# EAGLE schematic MainECU rev7 (EAGLE 9.2.2)
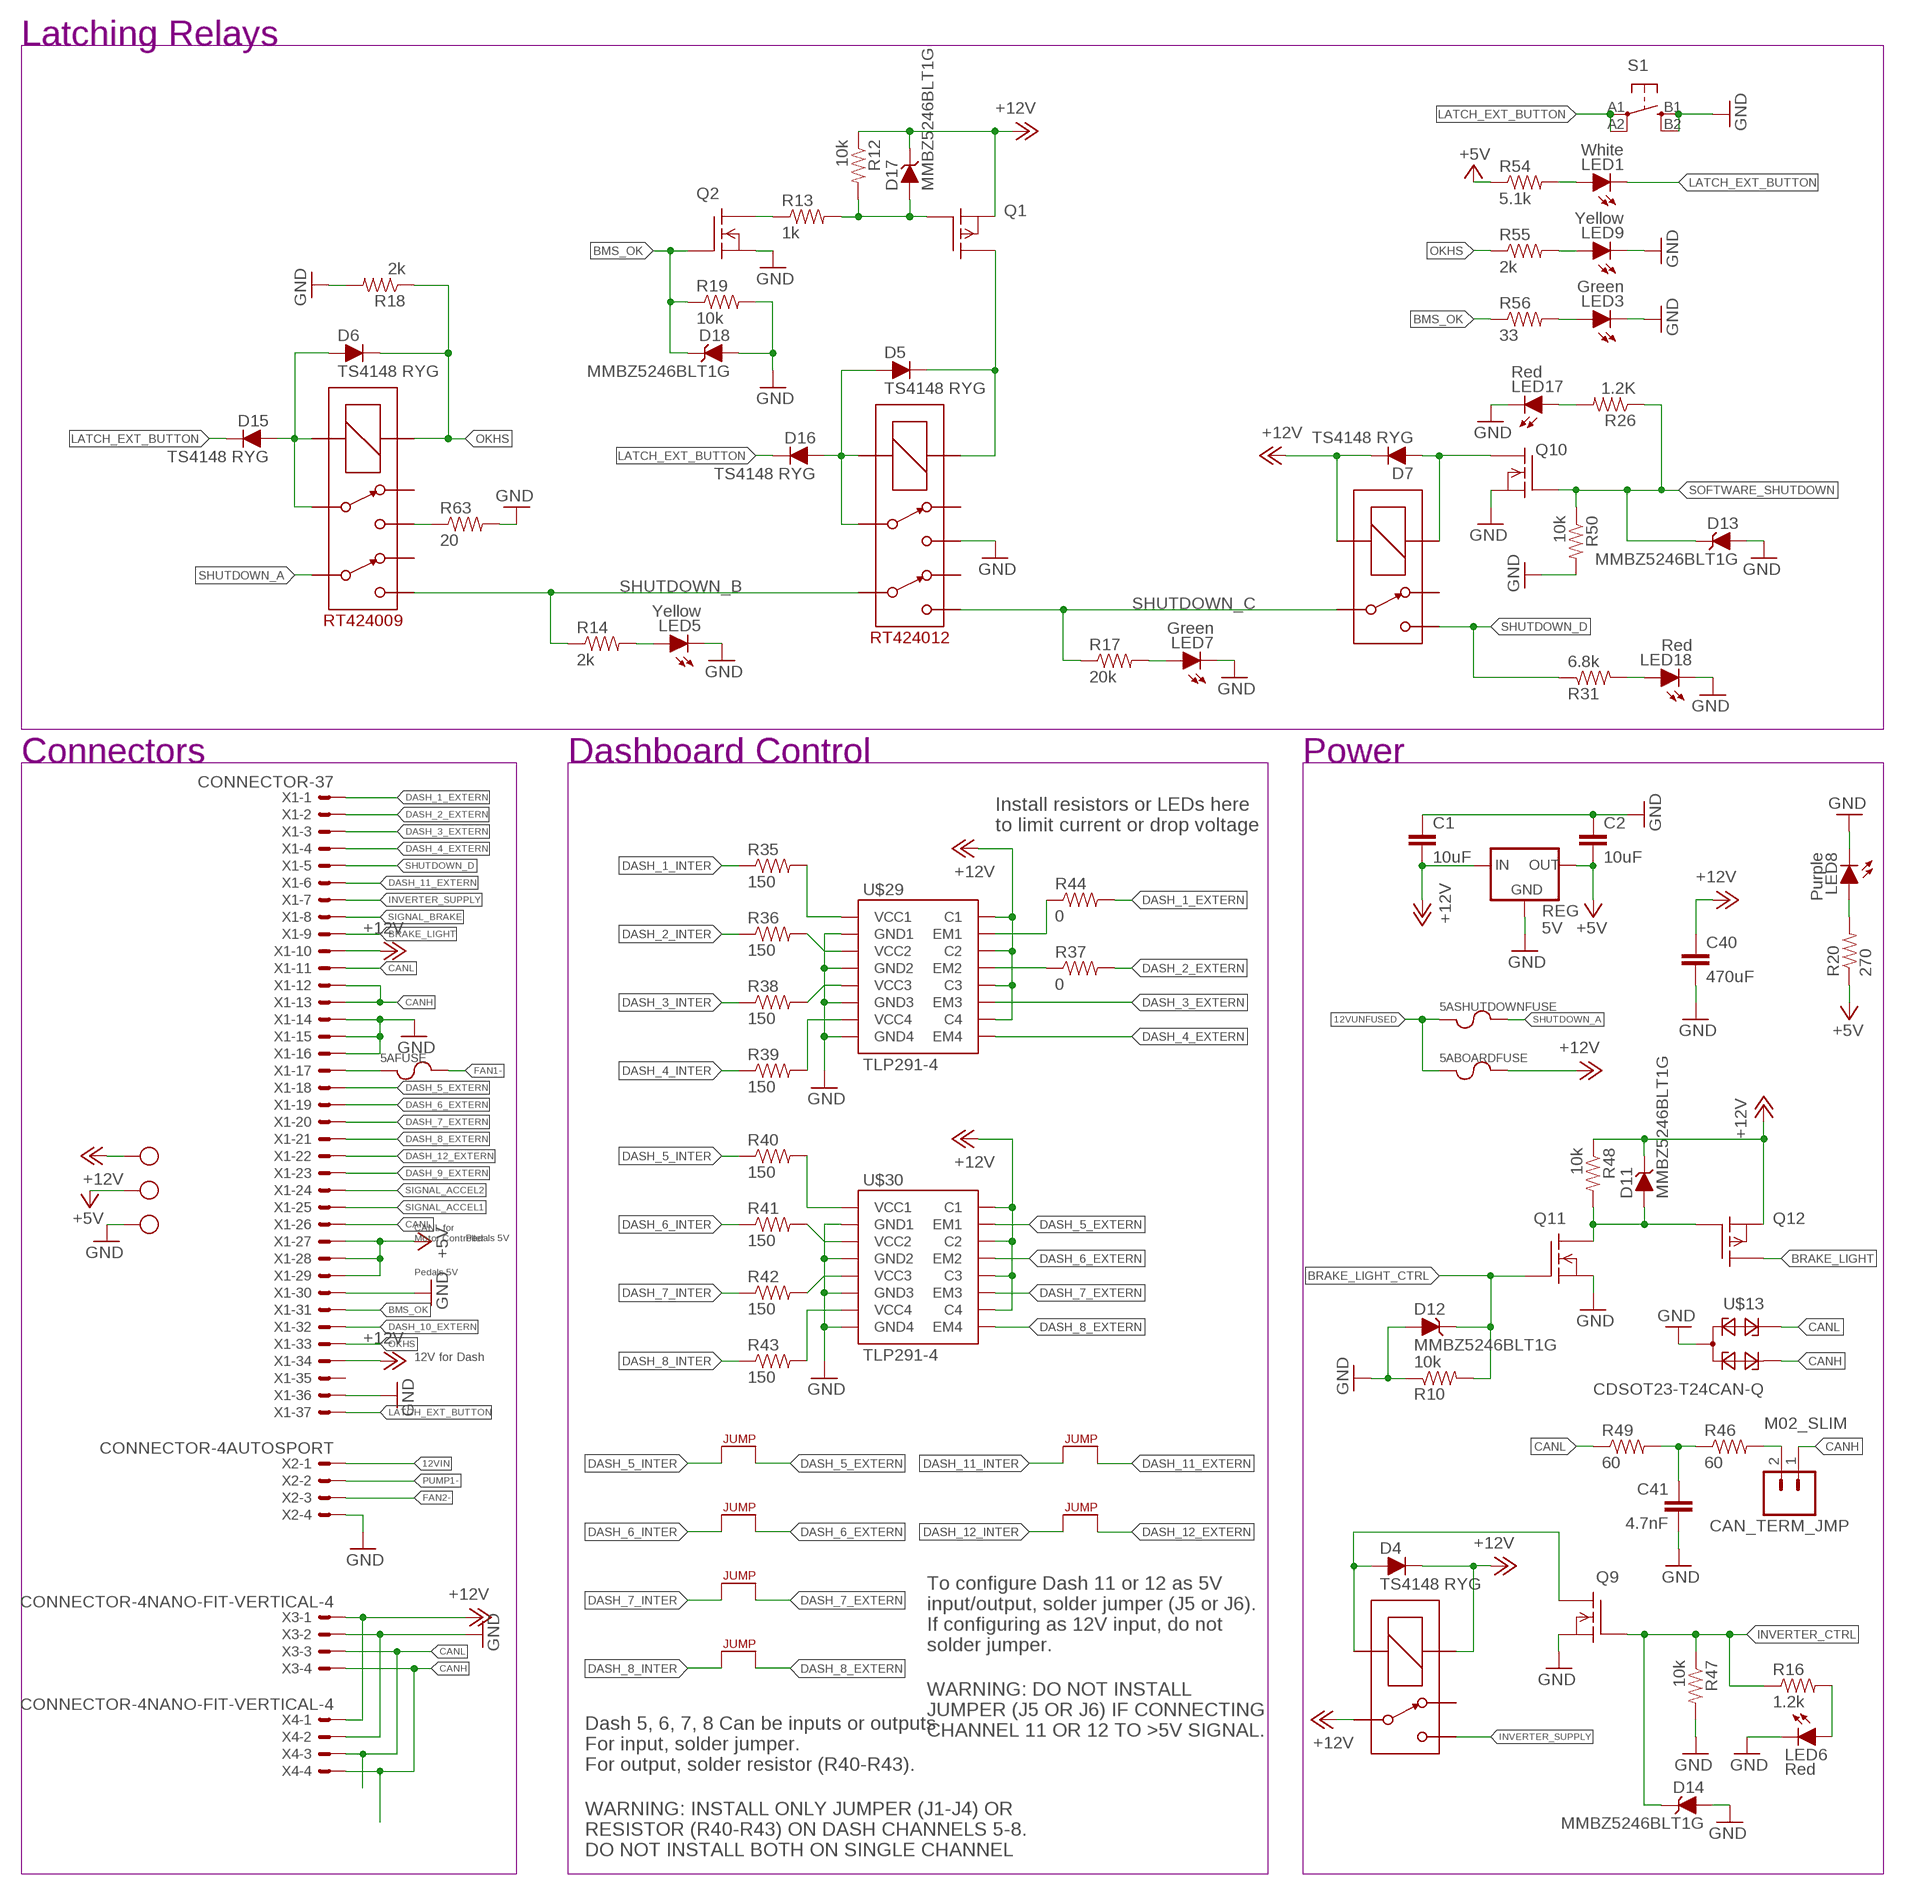
[diagram p0: schematic, sheet 1, part 1 of 2]
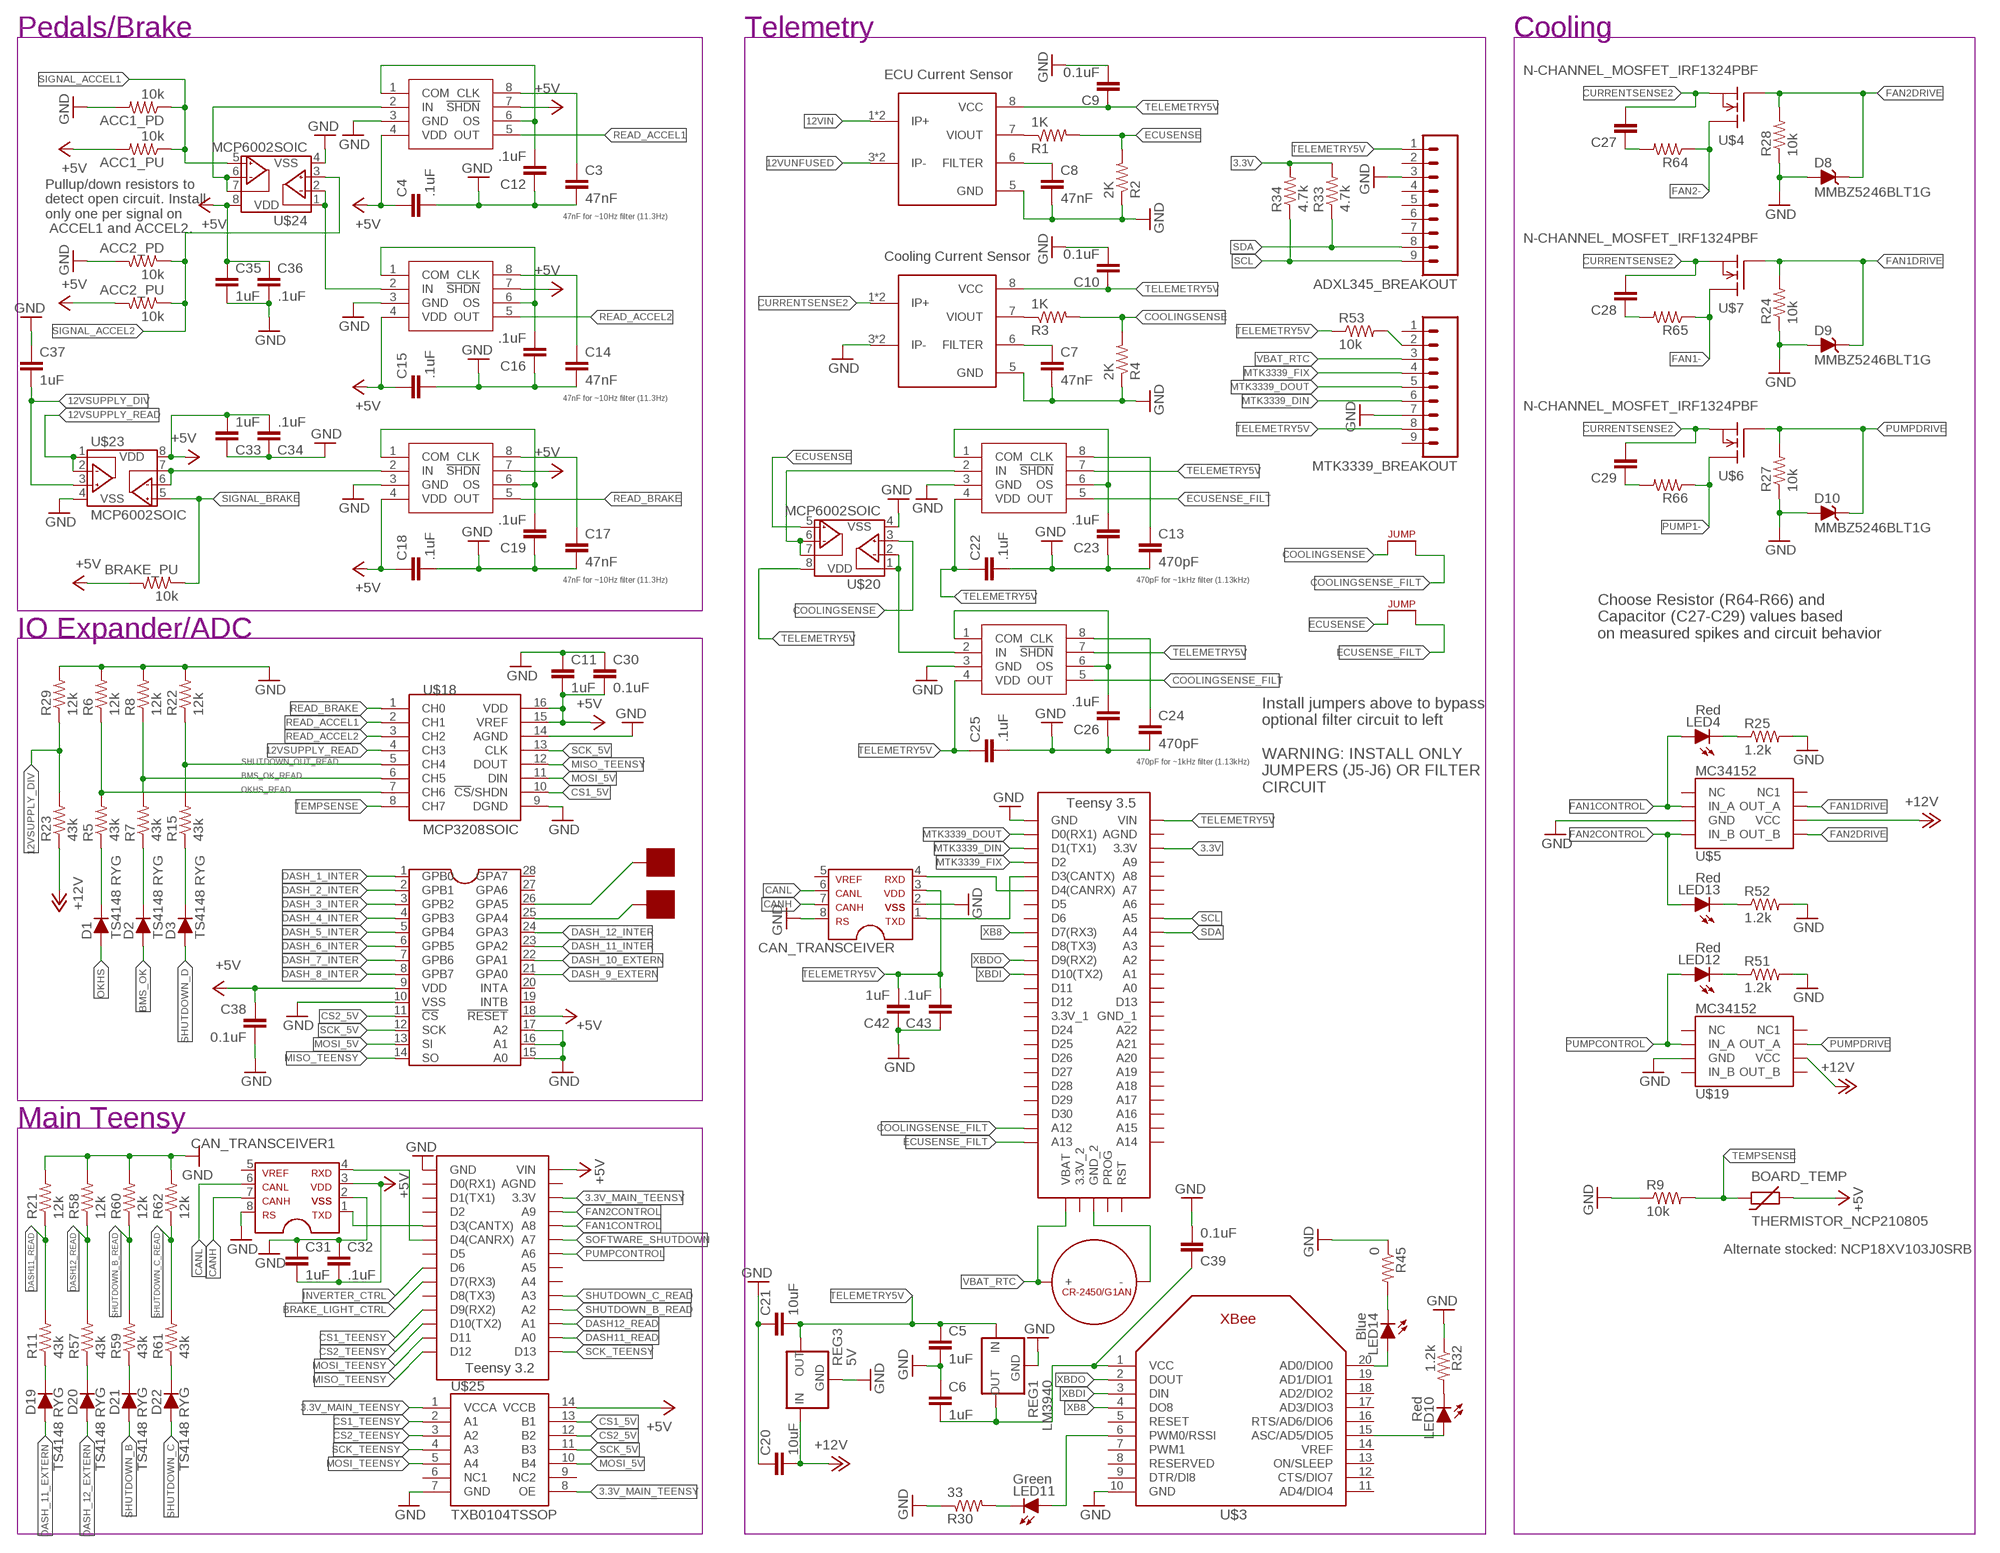
[diagram p1: schematic, sheet 1, part 2 of 2]

## Parts
5ABOARDFUSE  FUSE_MINIBLADE  [MINI-BLADE_FUSE_HOLDER]
5AFUSE  FUSE_MINIBLADE  [MINI-BLADE_FUSE_HOLDER]
5ASHUTDOWNFUSE  FUSE_MINIBLADE  [MINI-BLADE_FUSE_HOLDER]
ACC1_PD  10k  RESISTOR0805-RES  [0805]
ACC1_PU  10k  RESISTOR0805-RES  [0805]
ACC2_PD  10k  RESISTOR0805-RES  [0805]
ACC2_PU  10k  RESISTOR0805-RES  [0805]
ADXL345_BREAKOUT  M09  [1X09]
BMS_SHUTDOWN_RLY  RT424012  [RELAY_DPDT]
BOARD_TEMP  THERMISTOR_NCP210805  [0805]
BRAKE_PU  10k  RESISTOR0805-RES  [0805]
C1  10uF  CAP0805  [0805]
C2  10uF  CAP0805  [0805]
C3  47nF  CAP0805  [0805]
C4  .1uF  CAP0805  [0805]
C5  1uF  CAP0805  [0805]
C6  1uF  CAP0805  [0805]
C7  47nF  CAP0805  [0805]
C8  47nF  CAP0805  [0805]
C9  0.1uF  CAP0805  [0805]
C10  0.1uF  CAP0805  [0805]
C11  1uF  CAP0805  [0805]
C12  .1uF  CAP0805  [0805]
C13  470pF  CAP0805  [0805]
C14  47nF  CAP0805  [0805]
C15  .1uF  CAP0805  [0805]
C16  .1uF  CAP0805  [0805]
C17  47nF  CAP0805  [0805]
C18  .1uF  CAP0805  [0805]
C19  .1uF  CAP0805  [0805]
C20  10uF  CAP0805  [0805]
C21  10uF  CAP0805  [0805]
C22  .1uF  CAP0805  [0805]
C23  .1uF  CAP0805  [0805]
C24  470pF  CAP0805  [0805]
C25  .1uF  CAP0805  [0805]
C26  .1uF  CAP0805  [0805]
C27  CAP0805  [0805]
C28  CAP0805  [0805]
C29  CAP0805  [0805]
C30  0.1uF  CAP0805  [0805]
C31  1uF  CAP0805  [0805]
C32  .1uF  CAP0805  [0805]
C33  1uF  CAP0805  [0805]
C34  .1uF  CAP0805  [0805]
C35  1uF  CAP0805  [0805]
C36  .1uF  CAP0805  [0805]
C37  1uF  CAP0805  [0805]
C38  0.1uF  CAP0805  [0805]
C39  0.1uF  CAP0805  [0805]
C40  470uF  CAPPTH3  [CAP-PTH-LARGE]
C41  4.7nF  CAP0805  [0805]
C42  1uF  CAP0805  [0805]
C43  .1uF  CAP0805  [0805]
CAN_TERM_JMP  M02_SLIM  [1X02_SLIM]
CAN_TRANSCEIVER  MCP2551  [SOIC-08]
CAN_TRANSCEIVER1  MCP2551  [SOIC-08]
D1  TS4148 RYG  DIODE0805  [0805_D]
D2  TS4148 RYG  DIODE0805  [0805_D]
D3  TS4148 RYG  DIODE0805  [0805_D]
D4  TS4148 RYG  DIODE0805  [0805_D]
D5  TS4148 RYG  DIODE0805  [0805_D]
D6  TS4148 RYG  DIODE0805  [0805_D]
D7  TS4148 RYG  DIODE0805  [0805_D]
D8  MMBZ5246BLT1G  DIODE_ZENER  [SOT23]
D9  MMBZ5246BLT1G  DIODE_ZENER  [SOT23]
D10  MMBZ5246BLT1G  DIODE_ZENER  [SOT23]
D11  MMBZ5246BLT1G  DIODE_ZENER  [SOT23]
D12  MMBZ5246BLT1G  DIODE_ZENER  [SOT23]
D13  MMBZ5246BLT1G  DIODE_ZENER  [SOT23]
D14  MMBZ5246BLT1G  DIODE_ZENER  [SOT23]
D15  TS4148 RYG  DIODE0805  [0805_D]
D16  TS4148 RYG  DIODE0805  [0805_D]
D17  MMBZ5246BLT1G  DIODE_ZENER  [SOT23]
D18  MMBZ5246BLT1G  DIODE_ZENER  [SOT23]
D19  TS4148 RYG  DIODE0805  [0805_D]
D20  TS4148 RYG  DIODE0805  [0805_D]
D21  TS4148 RYG  DIODE0805  [0805_D]
D22  TS4148 RYG  DIODE0805  [0805_D]
IMD_SHUTDOWN_RLY  RT424009  [RELAY_DPDT]
INVERTER_PWR_RELAY  G5LE  [ZF112]
J1  JUMPER  [0805]
J2  JUMPER  [0805]
J3  JUMPER  [0805]
J4  JUMPER  [0805]
J5  JUMPER  [0805]
J6  JUMPER  [0805]
J7  JUMPER  [0805]
J8  JUMPER  [0805]
LED1  White  LED-0805  [LED-805]
LED3  Green  LED-0805  [LED-805]
LED4  Red  LED-0805  [LED-805]
LED5  Yellow  LED-0805  [LED-805]
LED6  Red  LED-0805  [LED-805]
LED7  Green  LED-0805  [LED-805]
LED8  Purple  LED-0805  [LED-805]
LED9  Yellow  LED-0805  [LED-805]
LED10  Red  LED-0805  [LED-805]
LED11  Green  LED-0805  [LED-805]
LED12  Red  LED-0805  [LED-805]
LED13  Red  LED-0805  [LED-805]
LED14  Blue  LED-0805  [LED-805]
LED17  Red  LED-0805  [LED-805]
LED18  Red  LED-0805  [LED-805]
MTK3339_BREAKOUT  M09  [1X09]
P1  SOLDER_PAD  [SOLDER_PAD_XSMALL]
P2  SOLDER_PAD  [SOLDER_PAD_XSMALL]
Q1  P-CHANNEL_MOSFET_DMP3099L-7  [SOT23]
Q2  DMG3406LSOT  [SOT23]
Q9  DMG3406LSOT  [SOT23]
Q10  DMG3406LSOT  [SOT23]
Q11  DMG3406LSOT  [SOT23]
Q12  P-CHANNEL_MOSFET_DMP3099L-7  [SOT23]
R1  1K  RESISTOR0805-RES  [0805]
R2  2K  RESISTOR0805-RES  [0805]
R3  1K  RESISTOR0805-RES  [0805]
R4  2K  RESISTOR0805-RES  [0805]
R5  43k  RESISTOR0805-RES  [0805]
R6  12k  RESISTOR0805-RES  [0805]
R7  43k  RESISTOR0805-RES  [0805]
R8  12k  RESISTOR0805-RES  [0805]
R9  10k  RESISTOR0805-RES  [0805]
R10  10k  RESISTOR0805-RES  [0805]
R11  43k  RESISTOR0805-RES  [0805]
R12  10k  RESISTOR0805-RES  [0805]
R13  1k  RESISTOR0805-RES  [0805]
R14  2k  RESISTOR0805-RES  [0805]
R15  43k  RESISTOR0805-RES  [0805]
R16  1.2k  RESISTOR0805-RES  [0805]
R17  20k  RESISTOR0805-RES  [0805]
R18  2k  RESISTOR0805-RES  [0805]
R19  10k  RESISTOR0805-RES  [0805]
R20  270  RESISTOR0805-RES  [0805]
R21  12k  RESISTOR0805-RES  [0805]
R22  12k  RESISTOR0805-RES  [0805]
R23  43k  RESISTOR0805-RES  [0805]
R24  10k  RESISTOR0805-RES  [0805]
R25  1.2k  RESISTOR0805-RES  [0805]
R26  1.2K  RESISTOR0805-RES  [0805]
R27  10k  RESISTOR0805-RES  [0805]
R28  10k  RESISTOR0805-RES  [0805]
R29  12k  RESISTOR0805-RES  [0805]
R30  33  RESISTOR0805-RES  [0805]
R31  6.8k  RESISTOR0805-RES  [0805]
R32  1.2k  RESISTOR0805-RES  [0805]
R33  4.7k  RESISTOR0805-RES  [0805]
R34  4.7k  RESISTOR0805-RES  [0805]
R35  150  RESISTOR0805-RES  [0805]
R36  150  RESISTOR0805-RES  [0805]
R37  0  RESISTOR0805-RES  [0805]
R38  150  RESISTOR0805-RES  [0805]
R39  150  RESISTOR0805-RES  [0805]
R40  150  RESISTOR0805-RES  [0805]
R41  150  RESISTOR0805-RES  [0805]
R42  150  RESISTOR0805-RES  [0805]
R43  150  RESISTOR0805-RES  [0805]
R44  0  RESISTOR0805-RES  [0805]
R45  0  RESISTOR0805-RES  [0805]
R46  60  RESISTOR0805-RES  [0805]
R47  10k  RESISTOR0805-RES  [0805]
R48  10k  RESISTOR0805-RES  [0805]
R49  60  RESISTOR0805-RES  [0805]
R50  10k  RESISTOR0805-RES  [0805]
R51  1.2k  RESISTOR0805-RES  [0805]
R52  1.2k  RESISTOR0805-RES  [0805]
R53  10k  RESISTOR0805-RES  [0805]
R54  5.1k  RESISTOR0805-RES  [0805]
R55  2k  RESISTOR0805-RES  [0805]
R56  33  RESISTOR0805-RES  [0805]
R57  43k  RESISTOR0805-RES  [0805]
R58  12k  RESISTOR0805-RES  [0805]
R59  43k  RESISTOR0805-RES  [0805]
R60  12k  RESISTOR0805-RES  [0805]
R61  43k  RESISTOR0805-RES  [0805]
R62  12k  RESISTOR0805-RES  [0805]
R63  20  RESISTOR0805-RES  [0805]
R64  RESISTOR0805-RES  [0805]
R65  RESISTOR0805-RES  [0805]
R66  RESISTOR0805-RES  [0805]
REG  5V  OKI-78SR-5  [OKI-78SR]
REG1  LM3940  [SOT223]
REG3  5V  OKI-78SR-5  [OKI-78SR]
S1  BTN_10-XXSMD  [TACTILE_SWITCH_SMD_6.2MM_TALL]
SOFTWARE_SHUTDOWN_RLY  G5LE  [ZF112]
U$1  TEENSY_3.2_SIMPLE  [TEENSY_3.2_SIMPLE]
U$2  TEENSY_3.5_EXT  [TEENSY_3.5_EXT]
U$3  XBEE  [XBEE]
U$4  N-CHANNEL_MOSFET_IRF1324PBF  N-CHANNEL_MOSFET_HOR_HOLE  [TO-220-H-HOLE]
U$5  MC34152  [SOIC-08]
U$6  N-CHANNEL_MOSFET_IRF1324PBF  N-CHANNEL_MOSFET_HOR_HOLE  [TO-220-H-HOLE]
U$7  N-CHANNEL_MOSFET_IRF1324PBF  N-CHANNEL_MOSFET_HOR_HOLE  [TO-220-H-HOLE]
U$8  TEST_POINT  [TEST_POINT]
U$9  ACS715_CURRENT_SENSOR  [SOP8]
U$10  ACS715_CURRENT_SENSOR  [SOP8]
U$11  TEST_POINT  [TEST_POINT]
U$12  TEST_POINT  [TEST_POINT]
U$13  CDSOT23-T24CAN-Q  [SOT23]
U$16  CR-2450/G1AN  [CR-2450/G1AN]
U$17  MCP23S17SSOP28  [SSOP28]
U$18  MCP3208SOIC  [SOIC-16]
U$19  MC34152  [SOIC-08]
U$20  MCP6002SOIC  [SOIC-08]
U$21  MAX7480  [SOIC-08]
U$22  MAX7480  [SOIC-08]
U$23  MCP6002SOIC  [SOIC-08]
U$24  MCP6002SOIC  [SOIC-08]
U$25  TXB0104TSSOP  [TSSOP-14]
U$26  MAX7480  [SOIC-08]
U$27  MAX7480  [SOIC-08]
U$28  MAX7480  [SOIC-08]
U$29  TLP291-4  [11-11F1]
U$30  TLP291-4  [11-11F1]
X1  CONNECTOR-37  [AUTOSPORT_14-35]
X2  CONNECTOR-4AUTOSPORT  [AUTOSPORT_12-04]
X3  CONNECTOR-4NANO-FIT-VERTICAL-4  [NANO-FIT_VERTICAL-4]
X4  CONNECTOR-4NANO-FIT-VERTICAL-4  [NANO-FIT_VERTICAL-4]

## Nets
3.3V: R33.2 R34.2 U$2.3.3V
3.3V_MAIN_TEENSY: U$1.3.3V U$25.1(VCCA) U$25.8(OE)
12VIN: U$9.1(IP+) U$9.2(IP+) X2.P$1
12VSUPPLY_DIV: C37.2 R23.2 R29.1 U$23.3(VINA+)
12VSUPPLY_READ: U$18.4(CH3) U$23.1(VOUTA) U$23.2(VINA-)
12VUNFUSED: 5ABOARDFUSE.L1 5ABOARDFUSE.L2 5ASHUTDOWNFUSE.L1 5ASHUTDOWNFUSE.L2 U$9.3(IP-) U$9.4(IP-)
+5V: ACC1_PU.2 ACC2_PU.2 BOARD_TEMP.1 BRAKE_PU.2 C2.2 C4.1 C11.2 C15.1 C18.1 C30.2 C31.2 C32.2 C33.2 C34.2 C35.1 C36.1 C38.1 CAN_TRANSCEIVER1.3 R20.1 R54.1 REG.3(OUT) U$1.VIN U$11.P$1 U$17.9(VDD) U$17.18(!RESET) U$18.15(VREF) U$18.16(VDD) U$23.8(VDD) U$24.8(VDD) U$25.14(VCCB) U$26.4(VDD) U$26.7(!SHDN) U$27.4(VDD) U$27.7(!SHDN) U$28.4(VDD) U$28.7(!SHDN) X1.P$27 X1.P$28 X1.P$29
+12V: 5ABOARDFUSE.R1 5ABOARDFUSE.R2 C1.2 C20.2 C40.1 D4.C D7.C D11.3(C) D17.3(C) INVERTER_PWR_RELAY.1(COIL+) INVERTER_PWR_RELAY.P Q1.2(S) Q12.2(S) R12.1 R23.1 R48.1 REG3.1(IN) REG.1(IN) SOFTWARE_SHUTDOWN_RLY.2(COIL-) U$5.6(VCC) U$8.P$1 U$19.6(VCC) U$29.10(C4) U$29.12(C3) U$29.14(C2) U$29.16(C1) U$30.10(C4) U$30.12(C3) U$30.14(C2) U$30.16(C1) X1.P$10 X1.P$34 X3.P$1 X4.P$1
BMS_OK: D2.A D18.3(C) Q2.1(G) R19.1 R56.1 X1.P$31
BMS_OK_READ: R7.2 R8.1 U$18.6(CH5)
BMS_OK_SW: BMS_SHUTDOWN_RLY.COIL+ D5.C Q1.3(D)
BMS_PWR_STEP: BMS_SHUTDOWN_RLY.3 BMS_SHUTDOWN_RLY.COIL- D5.A D16.A
BRAKE_LIGHT: Q12.3(D) X1.P$9
BRAKE_LIGHT_CTRL: D12.3(C) Q11.1(G) R10.2 U$1.D7(RX3)
CANH: CAN_TERM_JMP.1 CAN_TRANSCEIVER1.7 CAN_TRANSCEIVER.7 U$13.2 X1.P$12 X1.P$13 X3.P$4 X4.P$4
CANL: CAN_TRANSCEIVER1.6 CAN_TRANSCEIVER.6 R49.1 U$13.1 X1.P$11 X1.P$26 X3.P$3 X4.P$3
COOLINGSENSE: J5.2 R3.2 R4.2 U$20.3(VINA+)
COOLINGSENSE_FILT: J5.1 U$2.A12 U$22.5(OUT)
CS1_5V: U$18.10(!CS!/SHDN) U$25.13(B1)
CS1_TEENSY: U$1.D9(RX2) U$25.2(A1)
CS2_5V: U$17.11(!CS) U$25.12(B2)
CS2_TEENSY: U$1.D10(TX2) U$25.3(A2)
CURRENTSENSE2: C27.2 C28.2 C29.2 U$4.3(S) U$6.3(S) U$7.3(S) U$10.1(IP+) U$10.2(IP+)
DASH11_READ: R11.2 R21.1 U$1.A0
DASH12_READ: R57.2 R58.1 U$1.A1
DASH_1_EXTERN: R44.2 X1.P$1
DASH_1_INTER: R35.1 U$17.1(GPB0)
DASH_2_EXTERN: R37.2 X1.P$2
DASH_2_INTER: R36.1 U$17.2(GPB1)
DASH_3_EXTERN: U$29.11(EM3) X1.P$3
DASH_3_INTER: R38.1 U$17.3(GPB2)
DASH_4_EXTERN: U$29.9(EM4) X1.P$4
DASH_4_INTER: R39.1 U$17.4(GPB3)
DASH_5_EXTERN: J1.1 U$30.15(EM1) X1.P$18
DASH_5_INTER: J1.2 R40.1 U$17.5(GPB4)
DASH_6_EXTERN: J2.1 U$30.13(EM2) X1.P$19
DASH_6_INTER: J2.2 R41.1 U$17.6(GPB5)
DASH_7_EXTERN: J3.1 U$30.11(EM3) X1.P$20
DASH_7_INTER: J3.2 R42.1 U$17.7(GPB6)
DASH_8_EXTERN: J4.1 U$30.9(EM4) X1.P$21
DASH_8_INTER: J4.2 R43.1 U$17.8(GPB7)
DASH_9_EXTERN: U$17.21(GPA0) X1.P$23
DASH_10_EXTERN: U$17.22(GPA1) X1.P$32
DASH_11_EXTERN: D19.A J7.1 X1.P$6
DASH_11_INTER: J7.2 U$17.23(GPA2)
DASH_12_EXTERN: D20.A J8.1 X1.P$22
DASH_12_INTER: J8.2 U$17.24(GPA3)
ECUSENSE: J6.2 R1.2 R2.2 U$20.5(VINB+)
ECUSENSE_FILT: J6.1 U$2.A13 U$21.5(OUT)
FAN1-: 5AFUSE.R1 5AFUSE.R2 R65.1 U$7.2(D)
FAN1CONTROL: LED4.A U$1.A8 U$5.2(IN_A)
FAN1DRIVE: D9.3(C) R24.2 U$5.7(OUT_A) U$7.1(G)
FAN2-: R64.1 U$4.2(D) X2.P$3
FAN2CONTROL: LED13.A U$1.A9 U$5.4(IN_B)
FAN2DRIVE: D8.3(C) R28.2 U$4.1(G) U$5.5(OUT_B)
GND: ACC1_PD.2 ACC2_PD.2 ADXL345_BREAKOUT.3 BMS_SHUTDOWN_RLY.4 C1.1 C2.1 C3.2 C4.2 C5.2 C6.1 C7.2 C8.2 C9.2 C10.2 C11.1 C12.1 C13.2 C14.2 C15.2 C16.1 C17.2 C18.2 C19.1 C20.1 C21.1 C22.2 C23.1 C24.2 C25.2 C26.1 C30.1 C31.1 C32.1 C33.1 C34.1 C35.2 C36.2 C37.1 C38.2 C39.2 C40.2 C41.2 C42.1 C43.1 CAN_TRANSCEIVER1.2 CAN_TRANSCEIVER1.8 CAN_TRANSCEIVER.2 CAN_TRANSCEIVER.8 D8.1(A) D9.1(A) D10.1(A) D12.1(A) D13.1(A) D14.1(A) D18.1(A) LED3.C LED5.C LED6.C LED7.C LED8.C LED9.C LED17.C LED18.C MTK3339_BREAKOUT.7 Q2.2(S) Q9.2(S) Q10.2(S) Q11.2(S) R2.1 R4.1 R6.2 R8.2 R9.1 R10.1 R18.2 R19.2 R21.2 R22.2 R24.1 R25.2 R27.1 R28.1 R29.2 R30.1 R32.1 R45.1 R47.2 R50.2 R51.2 R52.2 R58.2 R60.2 R62.2 R63.2 REG1.2(GND) REG1.4(GND) REG3.2(GND) REG.2(GND) S1.B1(S) S1.B2(S1) U$1.GND U$2.GND U$3.10(GND) U$5.3(GND) U$9.5(GND) U$10.3(IP-) U$10.4(IP-) U$10.5(GND) U$12.P$1 U$13.3 U$17.10(VSS) U$17.15(A0) U$17.16(A1) U$17.17(A2) U$18.9(DGND) U$18.14(AGND) U$19.3(GND) U$20.4(VSS) U$21.3(GND) U$22.3(GND) U$23.4(VSS) U$24.4(VSS) U$25.7(GND) U$26.3(GND) U$27.3(GND) U$28.3(GND) U$29.2(GND1) U$29.4(GND2) U$29.6(GND3) U$29.8(GND4) U$30.2(GND1) U$30.4(GND2) U$30.6(GND3) U$30.8(GND4) X1.P$14 X1.P$15 X1.P$16 X1.P$30 X1.P$36 X2.P$4 X3.P$2 X4.P$2
IMD_PWR_STEP: D6.A D15.A IMD_SHUTDOWN_RLY.3 IMD_SHUTDOWN_RLY.COIL-
INVERTER_CTRL: D14.3(C) Q9.1(G) R16.1 R47.1 U$1.D6
INVERTER_SUPPLY: INVERTER_PWR_RELAY.S X1.P$7
LATCH_EXT_BUTTON: D15.C D16.C LED1.C S1.A1(P) S1.A2(P1) X1.P$37
MISO_TEENSY: U$1.D12 U$17.14(SO) U$18.12(DOUT)
MOSI_5V: U$17.13(SI) U$18.11(DIN) U$25.10(B4)
MOSI_TEENSY: U$1.D11 U$25.5(A4)
MTK3339_DIN: MTK3339_BREAKOUT.6 U$2.D1(TX1)
MTK3339_DOUT: MTK3339_BREAKOUT.5 U$2.D0(RX1)
MTK3339_FIX: MTK3339_BREAKOUT.4 U$2.D2
N$1: 5AFUSE.L1 5AFUSE.L2 X1.P$17
N$2: LED1.A R54.2
N$3: R1.1 U$9.7(VIOUT)
N$4: C12.2 U$27.1(COM) U$27.6(OS)
N$5: D20.C R57.1
N$6: R3.1 U$10.7(VIOUT)
N$7: MTK3339_BREAKOUT.2 R53.2
N$8: C8.1 U$9.6(FILTER)
N$9: LED3.A R56.2
N$10: D1.C R5.1
N$11: D2.C R7.1
N$12: D17.1(A) Q1.1(G) R12.2 R13.2
N$13: CAN_TRANSCEIVER.4 U$2.D4(CANRX)
N$14: CAN_TRANSCEIVER.1 U$2.D3(CANTX)
N$15: CAN_TRANSCEIVER1.4 U$1.D4(CANRX)
N$16: Q2.3(D) R13.1
N$17: CAN_TERM_JMP.2 R46.2
N$18: D19.C R11.1
N$19: LED5.A R14.2
N$20: U$20.1(VOUTA) U$20.2(VINA-) U$22.2(IN)
N$21: C3.1 U$27.8(CLK)
N$22: CAN_TRANSCEIVER1.1 U$1.D3(CANTX)
N$23: U$24.1(VOUTA) U$24.2(VINA-) U$28.2(IN)
N$24: U$24.6(VINB-) U$24.7(VOUTB) U$27.2(IN)
N$25: U$23.6(VINB-) U$23.7(VOUTB) U$26.2(IN)
N$26: LED9.A R55.2
N$27: D7.A Q10.3(D) SOFTWARE_SHUTDOWN_RLY.1(COIL+)
N$28: LED6.A R16.2
N$29: LED8.A R20.2
N$30: R36.2 U$29.3(VCC2)
N$31: D21.C R59.1
N$32: LED7.A R17.2
N$33: D3.C R15.1
N$34: D22.C R61.1
N$35: LED14.C R45.2
N$36: C16.2 U$28.1(COM) U$28.6(OS)
N$37: C19.2 U$26.1(COM) U$26.6(OS)
N$38: C14.1 U$28.8(CLK)
N$39: U$20.6(VINB-) U$20.7(VOUTB) U$21.2(IN)
N$40: LED18.A R31.2
N$41: C17.1 U$26.8(CLK)
N$42: R37.1 U$29.13(EM2)
N$43: C23.2 U$21.1(COM) U$21.6(OS)
N$44: C13.1 U$21.8(CLK)
N$45: LED11.C R30.2
N$46: LED17.A R26.2
N$47: LED11.A U$3.6(PWM0/RSSI)
N$48: C7.1 U$10.6(FILTER)
N$49: LED10.A U$3.15(ASC/AD5/DIO5)
N$50: LED10.C R32.2
N$51: R35.2 U$29.1(VCC1)
N$52: R38.2 U$29.5(VCC3)
N$53: R39.2 U$29.7(VCC4)
N$54: R40.2 U$30.1(VCC1)
N$55: R41.2 U$30.3(VCC2)
N$56: R42.2 U$30.5(VCC3)
N$57: R43.2 U$30.7(VCC4)
N$58: D11.1(A) Q11.3(D) Q12.1(G) R48.2
N$59: R44.1 U$29.15(EM1)
N$60: IMD_SHUTDOWN_RLY.4 R63.1
N$61: U$2.GND_2 U$16.-
N$62: C41.1 R46.1 R49.2
N$63: LED14.A U$3.20(AD0/DIO0)
N$65: C27.1 R64.2
N$66: D4.A INVERTER_PWR_RELAY.2(COIL-) Q9.3(D)
N$67: C26.2 U$22.1(COM) U$22.6(OS)
N$68: C24.1 U$22.8(CLK)
N$69: LED4.C R25.1
N$70: LED12.C R51.1
N$71: LED13.C R52.1
N$72: P1.P$1 U$17.25(GPA4)
N$73: P2.P$1 U$17.26(GPA5)
N$74: C28.1 R65.2
N$75: C29.1 R66.2
OKHS: D1.A D6.C IMD_SHUTDOWN_RLY.COIL+ R18.1 R55.1 X1.P$33
OKHS_READ: R5.2 R6.1 U$18.7(CH6)
PUMP1-: R66.1 U$6.2(D) X2.P$2
PUMPCONTROL: LED12.A U$1.A6 U$19.2(IN_A)
PUMPDRIVE: D10.3(C) R27.2 U$6.1(G) U$19.7(OUT_A)
READ_ACCEL1: U$18.2(CH1) U$27.5(OUT)
READ_ACCEL2: U$18.3(CH2) U$28.5(OUT)
READ_BRAKE: U$18.1(CH0) U$26.5(OUT)
SCK_5V: U$17.12(SCK) U$18.13(CLK) U$25.11(B3)
SCK_TEENSY: U$1.D13 U$25.4(A3)
SCL: ADXL345_BREAKOUT.9 R34.1 U$2.A5
SDA: ADXL345_BREAKOUT.8 R33.1 U$2.A4
SHUTDOWN_A: 5ASHUTDOWNFUSE.R1 5ASHUTDOWNFUSE.R2 IMD_SHUTDOWN_RLY.6
SHUTDOWN_B: BMS_SHUTDOWN_RLY.6 D21.A IMD_SHUTDOWN_RLY.5 R14.1
SHUTDOWN_B_READ: R59.2 R60.1 U$1.A2
SHUTDOWN_C: BMS_SHUTDOWN_RLY.5 D22.A R17.1 SOFTWARE_SHUTDOWN_RLY.P
SHUTDOWN_C_READ: R61.2 R62.1 U$1.A3
SHUTDOWN_D: D3.A R31.1 SOFTWARE_SHUTDOWN_RLY.S X1.P$5
SHUTDOWN_OUT_READ: R15.2 R22.1 U$18.5(CH4)
SIGNAL_ACCEL1: ACC1_PD.1 ACC1_PU.1 U$24.5(VINB+) X1.P$25
SIGNAL_ACCEL2: ACC2_PD.1 ACC2_PU.1 U$24.3(VINA+) X1.P$24
SIGNAL_BRAKE: BRAKE_PU.1 U$23.5(VINB+) X1.P$8
SOFTWARE_SHUTDOWN: D13.3(C) Q10.1(G) R26.1 R50.1 U$1.A7
TELEMETRY5V: ADXL345_BREAKOUT.1 C5.1 C9.1 C10.1 C21.2 C22.1 C25.1 C42.2 C43.2 CAN_TRANSCEIVER.3 MTK3339_BREAKOUT.8 R53.1 REG1.1(IN) REG3.3(OUT) U$2.VIN U$9.8(VCC) U$10.8(VCC) U$20.8(VDD) U$21.4(VDD) U$21.7(!SHDN) U$22.4(VDD) U$22.7(!SHDN)
TEMPSENSE: BOARD_TEMP.2 R9.2 U$18.8(CH7)
VBAT_RTC: MTK3339_BREAKOUT.3 U$2.VBAT U$16.+_0(+) U$16.+_1(+)
VCC: C6.2 C39.1 REG1.3(OUT) U$3.1(VCC)
XB8: U$2.D7(RX3) U$3.4(DO8)
XBDI: U$2.D10(TX2) U$3.3(DIN)
XBDO: U$2.D9(RX2) U$3.2(DOUT)
Unconnected: ADXL345_BREAKOUT.2 ADXL345_BREAKOUT.4 ADXL345_BREAKOUT.5 ADXL345_BREAKOUT.6 ADXL345_BREAKOUT.7 BMS_SHUTDOWN_RLY.2 BMS_SHUTDOWN_RLY.7 CAN_TRANSCEIVER1.5 CAN_TRANSCEIVER.5 IMD_SHUTDOWN_RLY.2 IMD_SHUTDOWN_RLY.7 INVERTER_PWR_RELAY.O MTK3339_BREAKOUT.1 MTK3339_BREAKOUT.9 SOFTWARE_SHUTDOWN_RLY.O U$1.A4 U$1.A5 U$1.AGND U$1.D0(RX1) U$1.D1(TX1) U$1.D2 U$1.D5 U$1.D8(TX3) U$2.3.3V_1 U$2.3.3V_2 U$2.A0 U$2.A1 U$2.A2 U$2.A3 U$2.A6 U$2.A7 U$2.A8 U$2.A9 U$2.A14 U$2.A15 U$2.A16 U$2.A17 U$2.A18 U$2.A19 U$2.A20 U$2.A21 U$2.A22 U$2.AGND U$2.D5 U$2.D6 U$2.D8(TX3) U$2.D11 U$2.D12 U$2.D13 U$2.D24 U$2.D25 U$2.D26 U$2.D27 U$2.D28 U$2.D29 U$2.D30 U$2.GND_1 U$2.PROG U$2.RST U$3.5(RESET) U$3.7(PWM1) U$3.8(RESERVED) U$3.9(DTR/DI8) U$3.11(AD4/DIO4) U$3.12(CTS/DIO7) U$3.13(ON/SLEEP) U$3.14(VREF) U$3.16(RTS/AD6/DIO6) U$3.17(AD3/DIO3) U$3.18(AD2/DIO2) U$3.19(AD1/DIO1) U$5.1(NC) U$5.8(NC1) U$17.19(INTB) U$17.20(INTA) U$17.27(GPA6) U$17.28(GPA7) U$19.1(NC) U$19.4(IN_B) U$19.5(OUT_B) U$19.8(NC1) U$25.6(NC1) U$25.9(NC2) X1.P$35

## Notes on the sheet
- Latching Relays | Pedals/Brake | Telemetry | Cooling
- ECU Current Sensor
- 47nF for ~10Hz filter (11.3Hz)
- Pullup/down resistors to 
  detect open circuit. Install
  only one per signal on
   ACCEL1 and ACCEL2.
- Cooling Current Sensor
- 47nF for ~10Hz filter (11.3Hz)
- 47nF for ~10Hz filter (11.3Hz) | 470pF for ~1kHz filter (1.13kHz)
- Connectors | Dashboard Control | Power
- IO Expander/ADC
- Choose Resistor (R64-R66) and
  Capacitor (C27-C29) values based
  on measured spikes and circuit behavior
- Install resistors or LEDs here
  to limit current or drop voltage
- 470pF for ~1kHz filter (1.13kHz)
- Install jumpers above to bypass
  optional filter circuit to left
  
  WARNING: INSTALL ONLY
  JUMPERS (J5-J6) OR FILTER
  CIRCUIT
- CANL for
  Motor Controller
- Pedals 5V
- Pedals 5V
- 12V for Dash
- Main Teensy
- Alternate stocked: NCP18XV103J0SRB
- To configure Dash 11 or 12 as 5V
  input/output, solder jumper (J5 or J6).
  If configuring as 12V input, do not
  solder jumper.
- WARNING: DO NOT INSTALL
  JUMPER (J5 OR J6) IF CONNECTING
  CHANNEL 11 OR 12 TO >5V SIGNAL.
- Dash 5, 6, 7, 8 Can be inputs or outputs
  For input, solder jumper.
  For output, solder resistor (R40-R43).
- WARNING: INSTALL ONLY JUMPER (J1-J4) OR
  RESISTOR (R40-R43) ON DASH CHANNELS 5-8.
  DO NOT INSTALL BOTH ON SINGLE CHANNEL

## Library data of the parts
5ABOARDFUSE 5AFUSE 5ASHUTDOWNFUSE = HyTechDevices:FUSE: Fuse/Fuseclips Keystone Electronics 3568 Fuse Mouser Part <http://www.mouser.com/ProductDetail/Keystone-Electronics/3568> Datasheet <http://www.mouser.com/ds/2/215/568-742601.pdf> Bussman/Eaton Midget Fuse Clip 1A3400 <http://www.mouser.com/ProductDetail/Bussmann-Eaton/BK-1A3400-09-R/?qs=sGAEpiMZZMuG%252bgnN5hGYGzzlAelq2OxnKqVSMVjq8I4%3d> Schurter 0751.0110 Brass Fuse Clip Datasheet <http://www.mouser.com/ds/2/358/typ_OG__Clip__5x20-2553.pdf>
ACC1_PD ACC1_PU ACC2_PD ACC2_PU BRAKE_PU R1-R66 = HyTechDevices:RESISTOR: Resistor Basic schematic elements and footprints for 0603, 1206, and PTH resistors.
ADXL345_BREAKOUT MTK3339_BREAKOUT = HyTechDevices:M09: Standard 9-pin 0.1" header. Source: Sparkfun <https://github.com/sparkfun/SparkFun-Eagle-Libraries>
BMS_SHUTDOWN_RLY = HyTechDevices:RT424012: TE/Schrack Double Pull Double Throw Relay 12VDC Datasheet <https://www.mouser.com/datasheet/2/418/NG_DS_RT2_1014-736201.pdf> Product Page <https://www.te.com/usa-en/product-6-1393243-3.html>
BOARD_TEMP = HyTechDevices:THERMISTOR_NCP21: Murata NCP Thermistor Datasheet <http://www.murata.com/~/media/webrenewal/support/library/catalog/products/thermistor/ntc/r44e.ashx>
C1-C43 = HyTechDevices:CAP: Capacitor Standard 0603 ceramic capacitor, and 0.1" leaded capacitor.
CAN_TERM_JMP = HyTechDevices:M02: Standard 2-pin 0.1" header. NOTES ON THE VARIANTS LOCK and LOCK_LONGPADS... This footprint was designed to help hold the alignment of a through-hole component (i.e. 6-pin header) while soldering it into place. You may notice that each hole has been shifted either up or down by 0.005 of an inch from it's more standard position (which is a perfectly straight line). This slight alteration caused the pins (the squares in the middle) to touch the edges of the holes. Because they are alternating, it causes a "brace" to hold the component in place. 0.005 has proven to be the perfect amount of "off-center" position when using our standard breakaway headers. Although looks a little odd when you look at the bare footprint, once you have a header in there, the alteration is very hard to notice. Also,if you push a header all the way into place, it is covered up entirely on the bottom side. This idea of altering the position of holes to aid alignment will be further integrated into the Sparkfun Library for other footprints. It can help hold any component with 3 or more connection pins. Note: The Sparkfun version includes many other packages including surface mount that may be of future interest. Source: Sparkfun <https://github.com/sparkfun/SparkFun-Eagle-Libraries>
CAN_TRANSCEIVER CAN_TRANSCEIVER1 = HyTechDevices:MCP2551: MCP2551 High-Speed CAN Transceiver Product Webpage <https://www.microchip.com/wwwproducts/en/MCP2551> Datasheet <http://ww1.microchip.com/downloads/en/DeviceDoc/21667f.pdf> This device is outdated It is replaced by MCP2561. Comparison Page <https://www.microchip.com/wwwproducts/ProductCompare/MCP2551/MCP2561> Product Webpage <https://www.microchip.com/wwwproducts/en/MCP2561> Datasheet <http://ww1.microchip.com/downloads/en/DeviceDoc/20005167C.pdf>
D1-D7 D15 D16 D19-D22 = HyTechDevices:DIODE: DIODE general purpose rectifier
D8-D14 D17 D18 = HyTechDevices:DIODE_ZENER: ZENER DIODE
IMD_SHUTDOWN_RLY = HyTechDevices:RT424009: TE/Schrack Double Pull Double Throw Relay 9VDC Datasheet <https://www.mouser.com/datasheet/2/418/NG_DS_RT2_1014-736201.pdf> Product Page <https://www.te.com/usa-en/product-6-1393243-2.html>
INVERTER_PWR_RELAY SOFTWARE_SHUTDOWN_RLY = HyTechDevices:G5LE: Omron G5LE SPST Relay 5 VDC, 12VDC, 24VDC models Coil voltage: 75% - 170% of nominal voltage Datasheet <https://www.omron.com/ecb/products/pdf/en-g5le.pdf>
J1-J8 = HyTechDevices:JUMPER: Jumper for changing operation of a device
LED1 LED3-LED14 LED17 LED18 = HyTechDevices:LED: Light Emitting Diode (LED) Source: Dangerous Prototypes Eagle Library <https://github.com/DangerousPrototypes/Eagle_Part_Library>
P1 P2 = HyTechDevices:SOLDER_PAD: Solder pad used to attach wires directly to PCB
Q1 Q12 = HyTechDevices:P-CHANNEL_MOSFET_DMP3099L-7: Diodes Incorporated P-Channel Enhancement Mode MOSFET Datasheet <http://www.mouser.com/ds/2/115/DMP3099L-266220.pdf>
Q2 Q9-Q11 = HyTechDevices:DMG3406L: Generic NPN MOSFET DMG3406L (SOT-23, 2.8 A 30V)
REG REG3 = HyTechDevices:OKI-78SR-5: Murata OKI-78SR 5V 1.5A Non-Isolated Switching Regulator DC/DC - Datasheet <https://power.murata.com/data/power/oki-78sr.pdf>
REG1 = HyTechDevices:LM3940: Texas Instruments LM3940 3.3V Linear Regulator Datasheet <http://www.ti.com/lit/ds/symlink/lm3940.pdf> Use with 0.47µF input capacitor and 33µF output capacitor.
S1 = HyTechDevices:BTN_10-XX: Small momentary tactile push button
U$1 = HyTechDevices:TEENSY_3.2_SIMPLE: Simple version of the Teensy 3.2 board that only uses the 2 main rows of pins, not the inner pins or the pins opposite the usb port.
U$2 = HyTechDevices:TEENSY_3.5_EXT: Simple version of the Teensy 3.5 board that only uses the 2 main rows of pins, plus the perpendicular row with VBat.
U$3 = HyTechDevices:XBEE: Source: Adafruit <https://github.com/adafruit/Adafruit-Eagle-Library>
U$4 U$6 U$7 = HyTechDevices:N-CHANNEL_MOSFET: Generic N-Channel MOSFET
U$5 U$19 = HyTechDevices:MC34152: Microchip MC34152 High Speed Dual MOSFET Driver
U$8 U$11 U$12 = HyTechDevices:TEST_POINT: Keystone Electronics Test Point 5005
U$9 U$10 = HyTechDevices:ACS715_CURRENT_SENSOR
U$13 = HyTechDevices:CDSOT23-T24CAN-Q: CAN Bus dual TVS array for transceiver ESD and surge protection
U$16 = HyTechDevices:CR-2450/G1AN: Panasonic CR2450 Battery through hole.
U$17 = HyTechDevices:MCP23S17
U$18 = HyTechDevices:MCP3208: Analog to Digital Converter
U$20 U$23 U$24 = HyTechDevices:MCP6002: Microchip MCP6002 Dual Channel Op Amp
U$21 U$22 U$26-U$28 = HyTechDevices:MAX7480: 8th-order lowpass butterworth filter
U$25 = HyTechDevices:TXB0104: Texas Instruments TXB0104 4-channel low voltage to high voltage Logic Level Shifter. Minimum input voltage level 1.8V. Maximum output voltage level 5.5V.
U$29 U$30 = HyTechDevices:TLP291-4: Toshiba Quad Channel Optocoupler TLP291-4 DC
X1 = HyTechDevices:CONNECTOR-37: Mini-Fit Junior connector 12 pole Source: http://www.molex.com
X2-X4 = HyTechDevices:CONNECTOR-4: Mini-Fit Junior connector 4 pole Source: http://www.molex.com